# EAGLE board wordclock-r2-grid-routed (EAGLE 5.11)
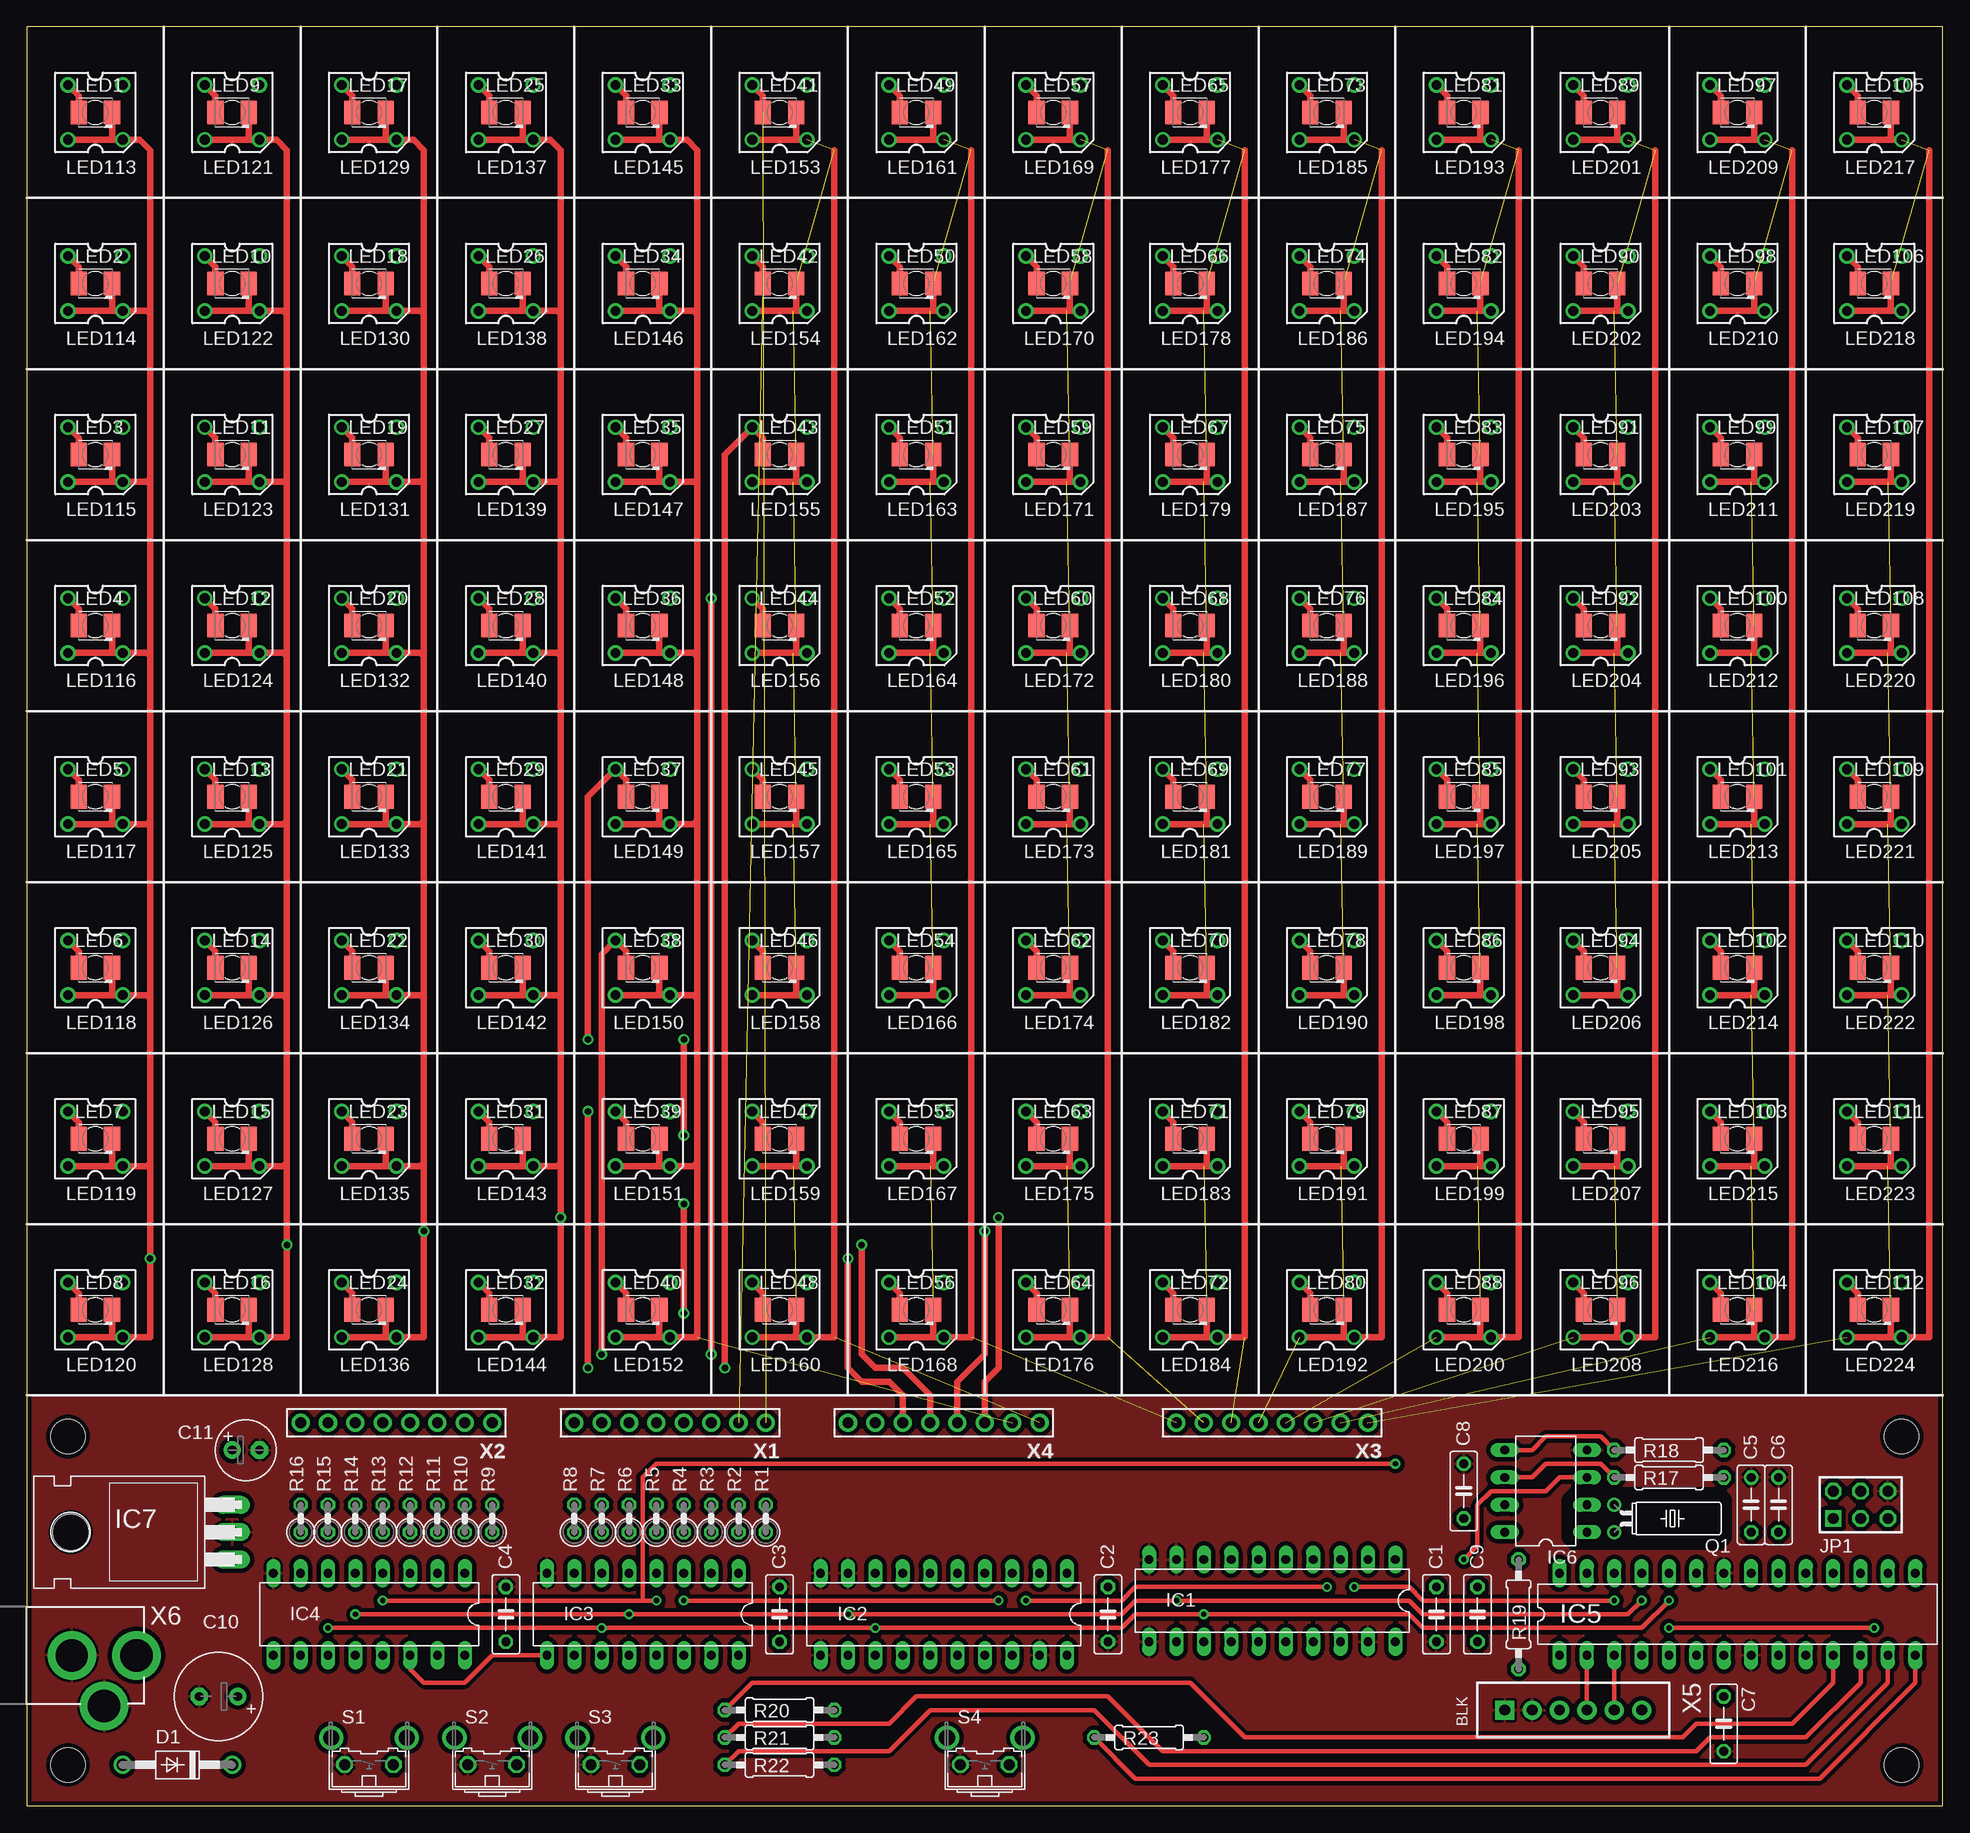
[diagram p2: board, top side]
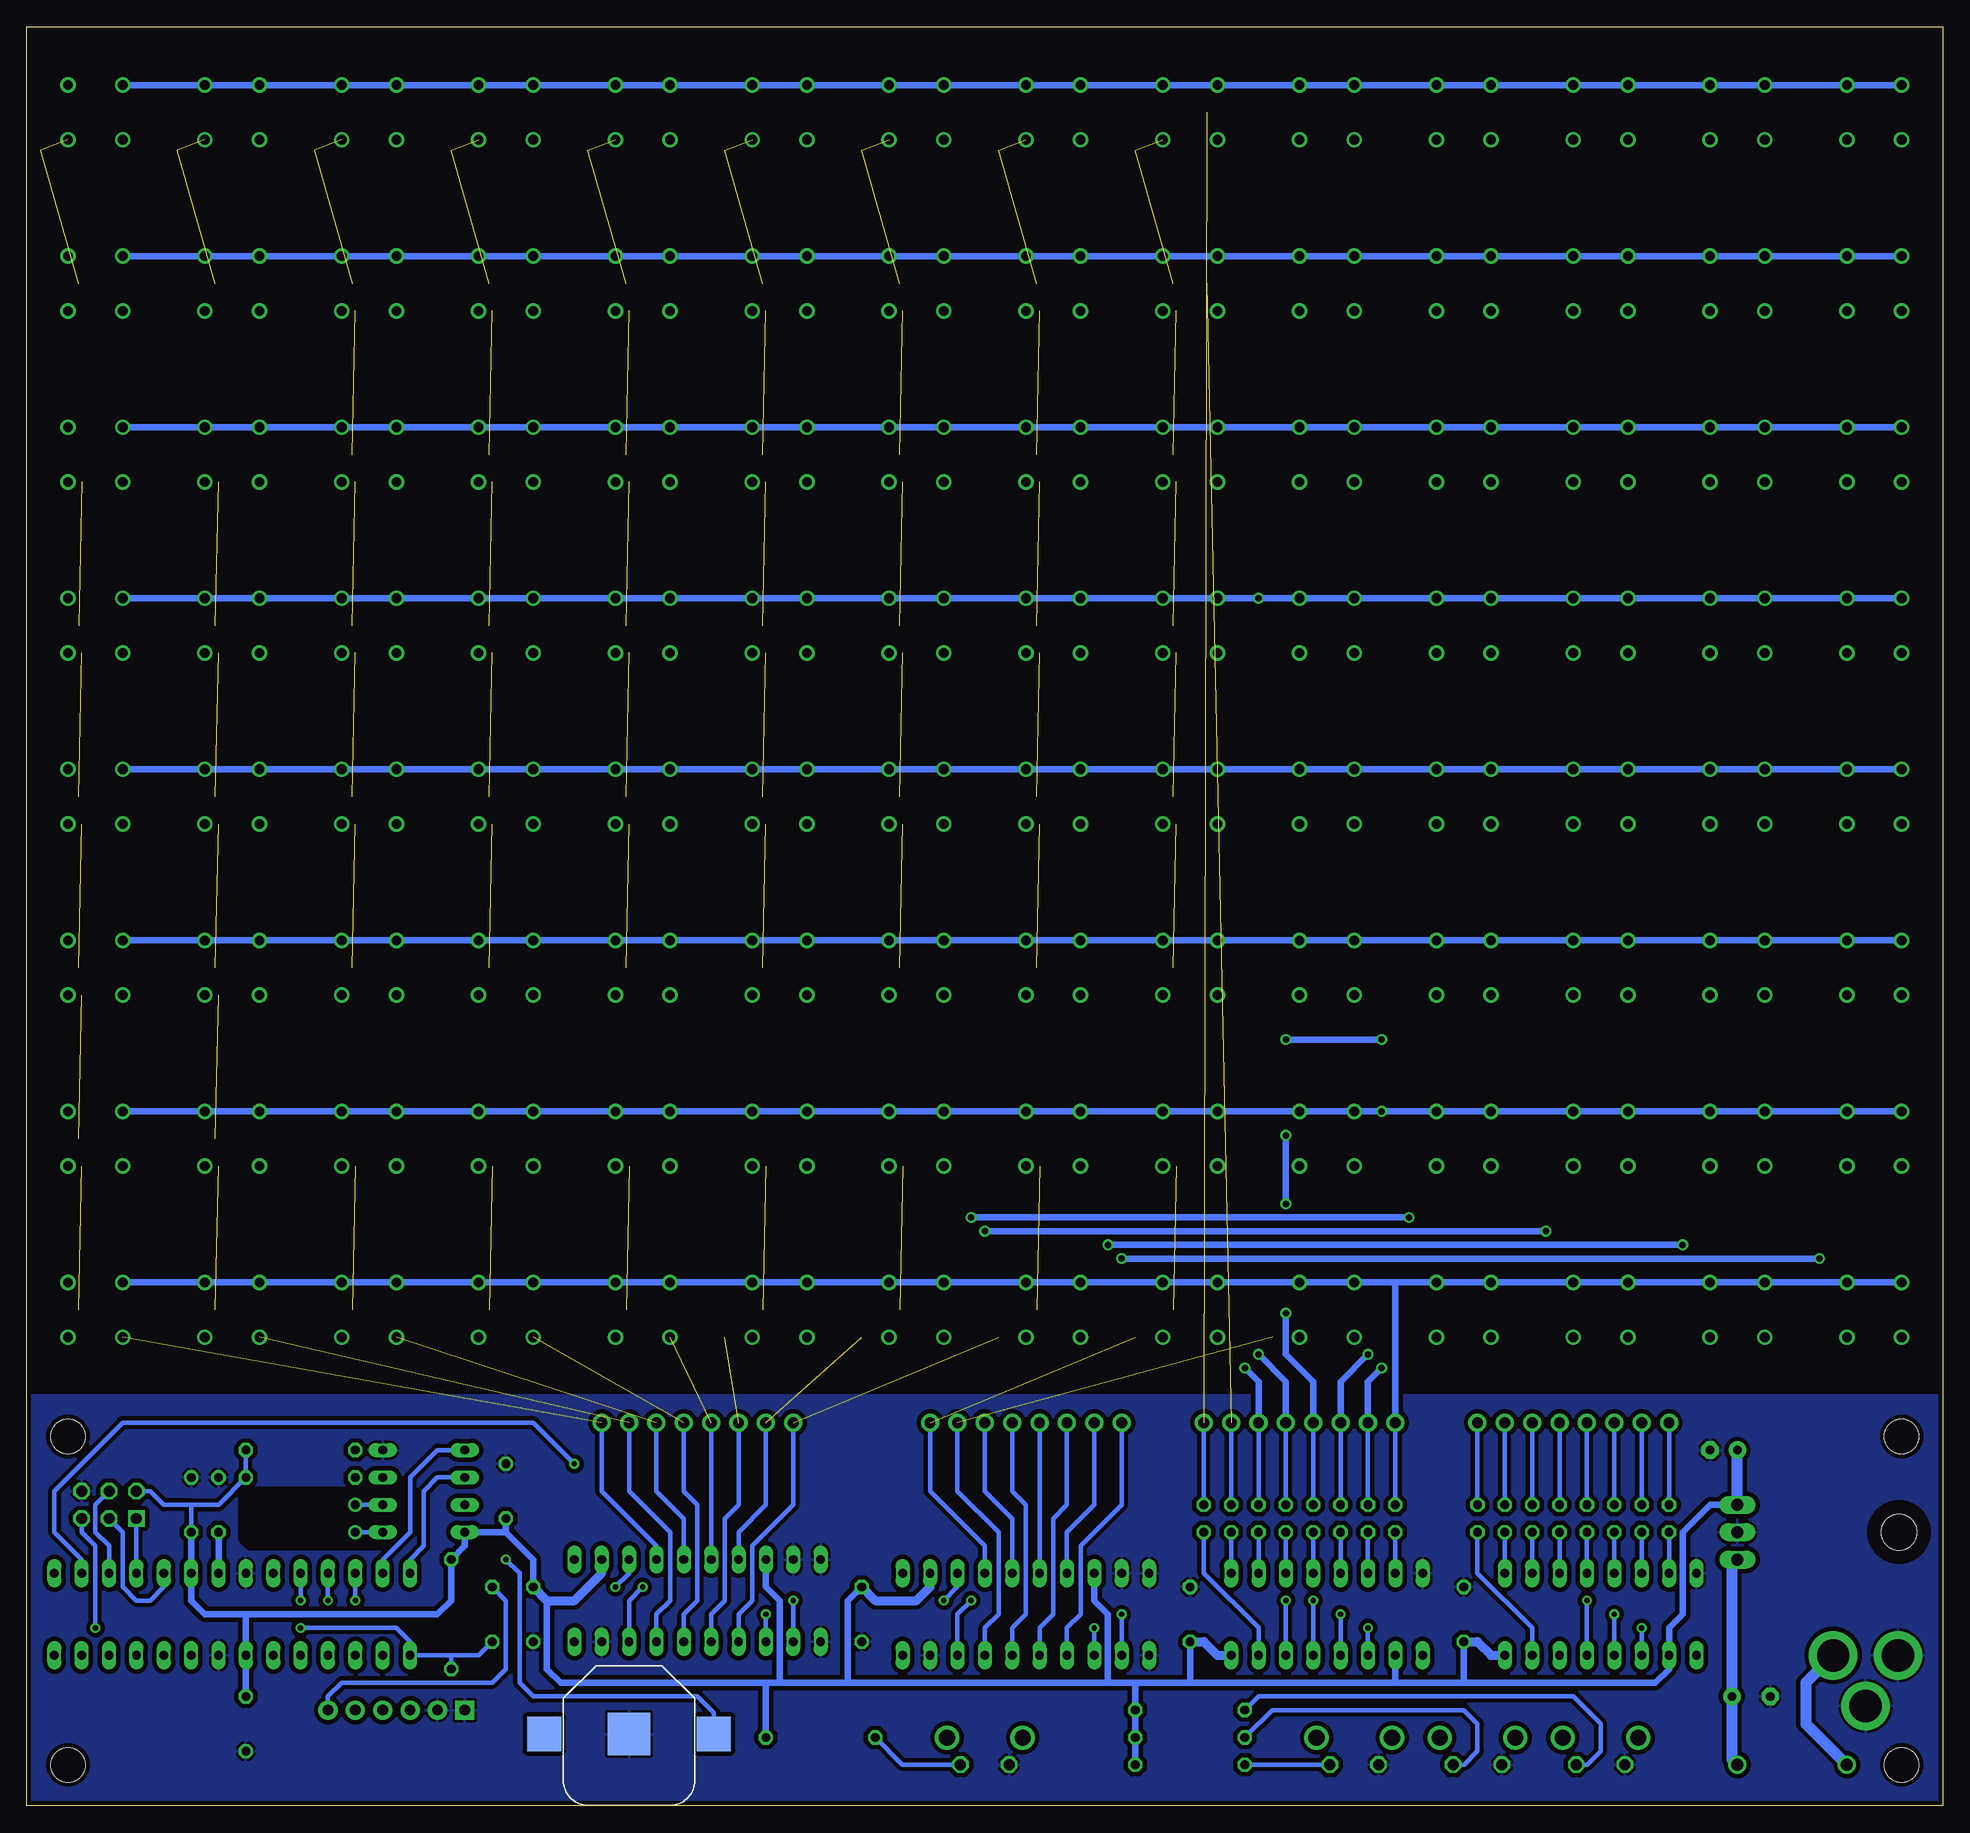
[diagram p3: board, bottom side, seen from below]

Size 177.8 x 165.1 mm. Coordinates in mm from the lower left corner, seen from the top.
Outline: 0,165.1 0,0 177.8,0 177.8,165.1 0,165.1
Copper layers (1*16): Top 0.035mm / dielectric 1.5mm / Bottom 0.035mm
Design rules "default": minimum track width 10mil, minimum drill 19mil, track to track 8mil, track to pad 8mil, pad to pad 8mil, via to via 8mil, smd to smd 8mil, copper to edge 10mil, drill to drill 8mil, minimum pad ring 10mil, minimum via ring 8mil, stop-mask expansion 4mil, vias tented up to drill 0mil, thermal gap 10mil
Holes 3.2 mm at 3.81,34.29 173.99,34.29 173.99,3.81 3.81,3.81
tRestrict: 8 lines
bRestrict: 8 lines

## Footprints (pad centres in the part's own frame; a part is rotated, then mirrored left to right if it is on the bottom)
BATTCON_12MM = smd 3.962 x 3.962: GND 0,0 | smd 3.175 x 3.175: PWR@1 -7.874,0; PWR@2 7.874,0
C050-025X075 = drill 0.813 octagon: 1 -2.54,0; 2 2.54,0
E3,5-8 = drill 0.813 pad 1.6 round: + -1.778,0 | drill 0.813 pad 1.6 octagon: - 1.778,0
E2,5-6 = drill 0.813 pad 1.6 round: + -1.27,0 | drill 0.813 pad 1.6 octagon: - 1.27,0
DO41-10 = drill 1.118 round: A 5.08,0; C -5.08,0
DIL20 = drill 0.813 long: 1 -11.43,-3.81; 2 -8.89,-3.81; 3 -6.35,-3.81; 4 -3.81,-3.81; 5 -1.27,-3.81; 6 1.27,-3.81; 7 3.81,-3.81; 8 6.35,-3.81; 9 8.89,-3.81; 10 11.43,-3.81; 11 11.43,3.81; 12 8.89,3.81; 13 6.35,3.81; 14 3.81,3.81; 15 1.27,3.81; 16 -1.27,3.81; 17 -3.81,3.81; 18 -6.35,3.81; 19 -8.89,3.81; 20 -11.43,3.81
DIL16 = drill 0.813 long: 1 -8.89,-3.81; 2 -6.35,-3.81; 3 -3.81,-3.81; 4 -1.27,-3.81; 5 1.27,-3.81; 6 3.81,-3.81; 7 6.35,-3.81; 8 8.89,-3.81; 9 8.89,3.81; 10 6.35,3.81; 11 3.81,3.81; 12 1.27,3.81; 13 -1.27,3.81; 14 -3.81,3.81; 15 -6.35,3.81; 16 -8.89,3.81
DIL28-3 = drill 0.813 long: 1 -16.51,-3.81; 2 -13.97,-3.81; 3 -11.43,-3.81; 4 -8.89,-3.81; 5 -6.35,-3.81; 6 -3.81,-3.81; 7 -1.27,-3.81; 8 1.27,-3.81; 9 3.81,-3.81; 10 6.35,-3.81; 11 8.89,-3.81; 12 11.43,-3.81; 13 13.97,-3.81; 14 16.51,-3.81; 15 16.51,3.81; 16 13.97,3.81; 17 11.43,3.81; 18 8.89,3.81; 19 6.35,3.81; 20 3.81,3.81; 21 1.27,3.81; 22 -1.27,3.81; 23 -3.81,3.81; 24 -6.35,3.81; 25 -8.89,3.81; 26 -11.43,3.81; 27 -13.97,3.81; 28 -16.51,3.81
DIL08 = drill 0.813 long: 1 -3.81,-3.81; 2 -1.27,-3.81; 3 1.27,-3.81; 4 3.81,-3.81; 5 3.81,3.81; 6 1.27,3.81; 7 -1.27,3.81; 8 -3.81,3.81
TO220H = drill 1.118 long: 1 -2.54,-10.16; 2 0,-10.16; 3 2.54,-10.16 | hole 3.302: 0,4.826
AVR-ISP-6 = drill 1.016 square: 1 -2.54,-1.27 | drill 1.016 octagon: 2 -2.54,1.27; 3 0,-1.27; 4 0,1.27; 5 2.54,-1.27; 6 2.54,1.27
KA-3528ASYC = smd 1.5 x 2.2: A -1.55,0; C 1.55,0
SUPERFLUX-7.6X7.6 = drill 0.9 pad 1.422 round: 1 -2.54,2.54; 2 2.54,2.54; 3 -2.54,-2.54; 4 2.54,-2.54
TC38H = drill 0.813 round: 1 -1.27,0; 2 1.27,0
0207/2V = drill 0.813 octagon: 1 -1.27,0; 2 1.27,0
0207/10 = drill 0.813 octagon: 1 -5.08,0; 2 5.08,0
B3F-31XX = drill 1.016 octagon: 1 -2.261,-1.245; 2 2.261,-1.245 | drill 1.499 pad 2.159 round: 3 -3.505,1.245; 4 3.505,1.245
100MIL-8 = drill 1 pad 1.676 round: 1 -8.89,0; 2 -6.35,0; 3 -3.81,0; 4 -1.27,0; 5 1.27,0; 6 3.81,0; 7 6.35,0; 8 8.89,0
USBCABLE-0.100-NOLBL = drill 1 pad 1.778 square: 1 0,-7.62 | drill 1 pad 1.778 round: 2 0,-5.08; 3 0,-2.54; 4 0,0; 5 0,2.54; 6 0,5.08
PJ-002 = drill 3 pad 4.5 round: 1 0,0; 2 0,6; 3 -4.7,3

## Placement (x,y rotation side)
BAT1  [BATTCON_12MM]  121.92,6.67 180 bottom
C1  [C050-025X075]  130.81,17.78 270 top
C2  [C050-025X075]  100.33,17.78 270 top
C3  [C050-025X075]  69.85,17.78 90 top
C4  [C050-025X075]  44.45,17.78 90 top
C5  [C050-025X075]  160.02,27.94 90 top
C6  [C050-025X075]  162.56,27.94 90 top
C7  [C050-025X075]  157.48,7.62 270 top
C8  [C050-025X075]  133.35,29.21 90 top
C9  [C050-025X075]  134.62,17.78 270 top
C10  100u  [E3,5-8]  17.78,10.16 180 top
C11  10u  [E2,5-6]  20.32,33.02 0 top
D1  1N4004  [DO41-10]  13.97,3.81 180 top
IC1  TPIC6B595  [DIL20]  115.57,19.05 180 top
IC2  TPIC6B595  [DIL20]  85.09,17.78 180 top
IC3  74LS595N  [DIL16]  57.15,17.78 180 top
IC4  74LS595N  [DIL16]  31.75,17.78 180 top
IC5  MEGA48/88/168-PU  [DIL28-3]  158.75,17.78 0 top
IC6  DS1307  [DIL08]  140.97,29.21 90 top
IC7  7805T  [TO220H]  8.89,25.4 90 top
JP1  AVR-ISP-6  [AVR-ISP-6]  170.18,27.94 0 top
LED1  [KA-3528ASYC]  6.35,157.16 0 top
LED2  [KA-3528ASYC]  6.35,141.29 0 top
LED3  [KA-3528ASYC]  6.35,125.41 0 top
LED4  [KA-3528ASYC]  6.35,109.54 0 top
LED5  [KA-3528ASYC]  6.35,93.66 0 top
LED6  [KA-3528ASYC]  6.35,77.79 0 top
LED7  [KA-3528ASYC]  6.35,61.91 0 top
LED8  [KA-3528ASYC]  6.35,46.04 0 top
LED9  [KA-3528ASYC]  19.05,157.16 0 top
LED10  [KA-3528ASYC]  19.05,141.29 0 top
LED11  [KA-3528ASYC]  19.05,125.41 0 top
LED12  [KA-3528ASYC]  19.05,109.54 0 top
LED13  [KA-3528ASYC]  19.05,93.66 0 top
LED14  [KA-3528ASYC]  19.05,77.79 0 top
LED15  [KA-3528ASYC]  19.05,61.91 0 top
LED16  [KA-3528ASYC]  19.05,46.04 0 top
LED17  [KA-3528ASYC]  31.75,157.16 0 top
LED18  [KA-3528ASYC]  31.75,141.29 0 top
LED19  [KA-3528ASYC]  31.75,125.41 0 top
LED20  [KA-3528ASYC]  31.75,109.54 0 top
LED21  [KA-3528ASYC]  31.75,93.66 0 top
LED22  [KA-3528ASYC]  31.75,77.79 0 top
LED23  [KA-3528ASYC]  31.75,61.91 0 top
LED24  [KA-3528ASYC]  31.75,46.04 0 top
LED25  [KA-3528ASYC]  44.45,157.16 0 top
LED26  [KA-3528ASYC]  44.45,141.29 0 top
LED27  [KA-3528ASYC]  44.45,125.41 0 top
LED28  [KA-3528ASYC]  44.45,109.54 0 top
LED29  [KA-3528ASYC]  44.45,93.66 0 top
LED30  [KA-3528ASYC]  44.45,77.79 0 top
LED31  [KA-3528ASYC]  44.45,61.91 0 top
LED32  [KA-3528ASYC]  44.45,46.04 0 top
LED33  [KA-3528ASYC]  57.15,157.16 0 top
LED34  [KA-3528ASYC]  57.15,141.29 0 top
LED35  [KA-3528ASYC]  57.15,125.41 0 top
LED36  [KA-3528ASYC]  57.15,109.54 0 top
LED37  [KA-3528ASYC]  57.15,93.66 0 top
LED38  [KA-3528ASYC]  57.15,77.79 0 top
LED39  [KA-3528ASYC]  57.15,61.91 0 top
LED40  [KA-3528ASYC]  57.15,46.04 0 top
LED41  [KA-3528ASYC]  69.85,157.16 0 top
LED42  [KA-3528ASYC]  69.85,141.29 0 top
LED43  [KA-3528ASYC]  69.85,125.41 0 top
LED44  [KA-3528ASYC]  69.85,109.54 0 top
LED45  [KA-3528ASYC]  69.85,93.66 0 top
LED46  [KA-3528ASYC]  69.85,77.79 0 top
LED47  [KA-3528ASYC]  69.85,61.91 0 top
LED48  [KA-3528ASYC]  69.85,46.04 0 top
LED49  [KA-3528ASYC]  82.55,157.16 0 top
LED50  [KA-3528ASYC]  82.55,141.29 0 top
LED51  [KA-3528ASYC]  82.55,125.41 0 top
LED52  [KA-3528ASYC]  82.55,109.54 0 top
LED53  [KA-3528ASYC]  82.55,93.66 0 top
LED54  [KA-3528ASYC]  82.55,77.79 0 top
LED55  [KA-3528ASYC]  82.55,61.91 0 top
LED56  [KA-3528ASYC]  82.55,46.04 0 top
LED57  [KA-3528ASYC]  95.25,157.16 0 top
LED58  [KA-3528ASYC]  95.25,141.29 0 top
LED59  [KA-3528ASYC]  95.25,125.41 0 top
LED60  [KA-3528ASYC]  95.25,109.54 0 top
LED61  [KA-3528ASYC]  95.25,93.66 0 top
LED62  [KA-3528ASYC]  95.25,77.79 0 top
LED63  [KA-3528ASYC]  95.25,61.91 0 top
LED64  [KA-3528ASYC]  95.25,46.04 0 top
LED65  [KA-3528ASYC]  107.95,157.16 0 top
LED66  [KA-3528ASYC]  107.95,141.29 0 top
LED67  [KA-3528ASYC]  107.95,125.41 0 top
LED68  [KA-3528ASYC]  107.95,109.54 0 top
LED69  [KA-3528ASYC]  107.95,93.66 0 top
LED70  [KA-3528ASYC]  107.95,77.79 0 top
LED71  [KA-3528ASYC]  107.95,61.91 0 top
LED72  [KA-3528ASYC]  107.95,46.04 0 top
LED73  [KA-3528ASYC]  120.65,157.16 0 top
LED74  [KA-3528ASYC]  120.65,141.29 0 top
LED75  [KA-3528ASYC]  120.65,125.41 0 top
LED76  [KA-3528ASYC]  120.65,109.54 0 top
LED77  [KA-3528ASYC]  120.65,93.66 0 top
LED78  [KA-3528ASYC]  120.65,77.79 0 top
LED79  [KA-3528ASYC]  120.65,61.91 0 top
LED80  [KA-3528ASYC]  120.65,46.04 0 top
LED81  [KA-3528ASYC]  133.35,157.16 0 top
LED82  [KA-3528ASYC]  133.35,141.29 0 top
LED83  [KA-3528ASYC]  133.35,125.41 0 top
LED84  [KA-3528ASYC]  133.35,109.54 0 top
LED85  [KA-3528ASYC]  133.35,93.66 0 top
LED86  [KA-3528ASYC]  133.35,77.79 0 top
LED87  [KA-3528ASYC]  133.35,61.91 0 top
LED88  [KA-3528ASYC]  133.35,46.04 0 top
LED89  [KA-3528ASYC]  146.05,157.16 0 top
LED90  [KA-3528ASYC]  146.05,141.29 0 top
LED91  [KA-3528ASYC]  146.05,125.41 0 top
LED92  [KA-3528ASYC]  146.05,109.54 0 top
LED93  [KA-3528ASYC]  146.05,93.66 0 top
LED94  [KA-3528ASYC]  146.05,77.79 0 top
LED95  [KA-3528ASYC]  146.05,61.91 0 top
LED96  [KA-3528ASYC]  146.05,46.04 0 top
LED97  [KA-3528ASYC]  158.75,157.16 0 top
LED98  [KA-3528ASYC]  158.75,141.29 0 top
LED99  [KA-3528ASYC]  158.75,125.41 0 top
LED100  [KA-3528ASYC]  158.75,109.54 0 top
LED101  [KA-3528ASYC]  158.75,93.66 0 top
LED102  [KA-3528ASYC]  158.75,77.79 0 top
LED103  [KA-3528ASYC]  158.75,61.91 0 top
LED104  [KA-3528ASYC]  158.75,46.04 0 top
LED105  [KA-3528ASYC]  171.45,157.16 0 top
LED106  [KA-3528ASYC]  171.45,141.29 0 top
LED107  [KA-3528ASYC]  171.45,125.41 0 top
LED108  [KA-3528ASYC]  171.45,109.54 0 top
LED109  [KA-3528ASYC]  171.45,93.66 0 top
LED110  [KA-3528ASYC]  171.45,77.79 0 top
LED111  [KA-3528ASYC]  171.45,61.91 0 top
LED112  [KA-3528ASYC]  171.45,46.04 0 top
LED113  [SUPERFLUX-7.6X7.6]  6.35,157.16 90 top
LED114  [SUPERFLUX-7.6X7.6]  6.35,141.29 90 top
LED115  [SUPERFLUX-7.6X7.6]  6.35,125.41 90 top
LED116  [SUPERFLUX-7.6X7.6]  6.35,109.54 90 top
LED117  [SUPERFLUX-7.6X7.6]  6.35,93.66 90 top
LED118  [SUPERFLUX-7.6X7.6]  6.35,77.79 90 top
LED119  [SUPERFLUX-7.6X7.6]  6.35,61.91 90 top
LED120  [SUPERFLUX-7.6X7.6]  6.35,46.04 90 top
LED121  [SUPERFLUX-7.6X7.6]  19.05,157.16 90 top
LED122  [SUPERFLUX-7.6X7.6]  19.05,141.29 90 top
LED123  [SUPERFLUX-7.6X7.6]  19.05,125.41 90 top
LED124  [SUPERFLUX-7.6X7.6]  19.05,109.54 90 top
LED125  [SUPERFLUX-7.6X7.6]  19.05,93.66 90 top
LED126  [SUPERFLUX-7.6X7.6]  19.05,77.79 90 top
LED127  [SUPERFLUX-7.6X7.6]  19.05,61.91 90 top
LED128  [SUPERFLUX-7.6X7.6]  19.05,46.04 90 top
LED129  [SUPERFLUX-7.6X7.6]  31.75,157.16 90 top
LED130  [SUPERFLUX-7.6X7.6]  31.75,141.29 90 top
LED131  [SUPERFLUX-7.6X7.6]  31.75,125.41 90 top
LED132  [SUPERFLUX-7.6X7.6]  31.75,109.54 90 top
LED133  [SUPERFLUX-7.6X7.6]  31.75,93.66 90 top
LED134  [SUPERFLUX-7.6X7.6]  31.75,77.79 90 top
LED135  [SUPERFLUX-7.6X7.6]  31.75,61.91 90 top
LED136  [SUPERFLUX-7.6X7.6]  31.75,46.04 90 top
LED137  [SUPERFLUX-7.6X7.6]  44.45,157.16 90 top
LED138  [SUPERFLUX-7.6X7.6]  44.45,141.29 90 top
LED139  [SUPERFLUX-7.6X7.6]  44.45,125.41 90 top
LED140  [SUPERFLUX-7.6X7.6]  44.45,109.54 90 top
LED141  [SUPERFLUX-7.6X7.6]  44.45,93.66 90 top
LED142  [SUPERFLUX-7.6X7.6]  44.45,77.79 90 top
LED143  [SUPERFLUX-7.6X7.6]  44.45,61.91 90 top
LED144  [SUPERFLUX-7.6X7.6]  44.45,46.04 90 top
LED145  [SUPERFLUX-7.6X7.6]  57.15,157.16 90 top
LED146  [SUPERFLUX-7.6X7.6]  57.15,141.29 90 top
LED147  [SUPERFLUX-7.6X7.6]  57.15,125.41 90 top
LED148  [SUPERFLUX-7.6X7.6]  57.15,109.54 90 top
LED149  [SUPERFLUX-7.6X7.6]  57.15,93.66 90 top
LED150  [SUPERFLUX-7.6X7.6]  57.15,77.79 90 top
LED151  [SUPERFLUX-7.6X7.6]  57.15,61.91 90 top
LED152  [SUPERFLUX-7.6X7.6]  57.15,46.04 90 top
LED153  [SUPERFLUX-7.6X7.6]  69.85,157.16 90 top
LED154  [SUPERFLUX-7.6X7.6]  69.85,141.29 90 top
LED155  [SUPERFLUX-7.6X7.6]  69.85,125.41 90 top
LED156  [SUPERFLUX-7.6X7.6]  69.85,109.54 90 top
LED157  [SUPERFLUX-7.6X7.6]  69.85,93.66 90 top
LED158  [SUPERFLUX-7.6X7.6]  69.85,77.79 90 top
LED159  [SUPERFLUX-7.6X7.6]  69.85,61.91 90 top
LED160  [SUPERFLUX-7.6X7.6]  69.85,46.04 90 top
LED161  [SUPERFLUX-7.6X7.6]  82.55,157.16 90 top
LED162  [SUPERFLUX-7.6X7.6]  82.55,141.29 90 top
LED163  [SUPERFLUX-7.6X7.6]  82.55,125.41 90 top
LED164  [SUPERFLUX-7.6X7.6]  82.55,109.54 90 top
LED165  [SUPERFLUX-7.6X7.6]  82.55,93.66 90 top
LED166  [SUPERFLUX-7.6X7.6]  82.55,77.79 90 top
LED167  [SUPERFLUX-7.6X7.6]  82.55,61.91 90 top
LED168  [SUPERFLUX-7.6X7.6]  82.55,46.04 90 top
LED169  [SUPERFLUX-7.6X7.6]  95.25,157.16 90 top
LED170  [SUPERFLUX-7.6X7.6]  95.25,141.29 90 top
LED171  [SUPERFLUX-7.6X7.6]  95.25,125.41 90 top
LED172  [SUPERFLUX-7.6X7.6]  95.25,109.54 90 top
LED173  [SUPERFLUX-7.6X7.6]  95.25,93.66 90 top
LED174  [SUPERFLUX-7.6X7.6]  95.25,77.79 90 top
LED175  [SUPERFLUX-7.6X7.6]  95.25,61.91 90 top
LED176  [SUPERFLUX-7.6X7.6]  95.25,46.04 90 top
LED177  [SUPERFLUX-7.6X7.6]  107.95,157.16 90 top
LED178  [SUPERFLUX-7.6X7.6]  107.95,141.29 90 top
LED179  [SUPERFLUX-7.6X7.6]  107.95,125.41 90 top
LED180  [SUPERFLUX-7.6X7.6]  107.95,109.54 90 top
LED181  [SUPERFLUX-7.6X7.6]  107.95,93.66 90 top
LED182  [SUPERFLUX-7.6X7.6]  107.95,77.79 90 top
LED183  [SUPERFLUX-7.6X7.6]  107.95,61.91 90 top
LED184  [SUPERFLUX-7.6X7.6]  107.95,46.04 90 top
LED185  [SUPERFLUX-7.6X7.6]  120.65,157.16 90 top
LED186  [SUPERFLUX-7.6X7.6]  120.65,141.29 90 top
LED187  [SUPERFLUX-7.6X7.6]  120.65,125.41 90 top
LED188  [SUPERFLUX-7.6X7.6]  120.65,109.54 90 top
LED189  [SUPERFLUX-7.6X7.6]  120.65,93.66 90 top
LED190  [SUPERFLUX-7.6X7.6]  120.65,77.79 90 top
LED191  [SUPERFLUX-7.6X7.6]  120.65,61.91 90 top
LED192  [SUPERFLUX-7.6X7.6]  120.65,46.04 90 top
LED193  [SUPERFLUX-7.6X7.6]  133.35,157.16 90 top
LED194  [SUPERFLUX-7.6X7.6]  133.35,141.29 90 top
LED195  [SUPERFLUX-7.6X7.6]  133.35,125.41 90 top
LED196  [SUPERFLUX-7.6X7.6]  133.35,109.54 90 top
LED197  [SUPERFLUX-7.6X7.6]  133.35,93.66 90 top
LED198  [SUPERFLUX-7.6X7.6]  133.35,77.79 90 top
LED199  [SUPERFLUX-7.6X7.6]  133.35,61.91 90 top
LED200  [SUPERFLUX-7.6X7.6]  133.35,46.04 90 top
LED201  [SUPERFLUX-7.6X7.6]  146.05,157.16 90 top
LED202  [SUPERFLUX-7.6X7.6]  146.05,141.29 90 top
LED203  [SUPERFLUX-7.6X7.6]  146.05,125.41 90 top
LED204  [SUPERFLUX-7.6X7.6]  146.05,109.54 90 top
LED205  [SUPERFLUX-7.6X7.6]  146.05,93.66 90 top
LED206  [SUPERFLUX-7.6X7.6]  146.05,77.79 90 top
LED207  [SUPERFLUX-7.6X7.6]  146.05,61.91 90 top
LED208  [SUPERFLUX-7.6X7.6]  146.05,46.04 90 top
LED209  [SUPERFLUX-7.6X7.6]  158.75,157.16 90 top
LED210  [SUPERFLUX-7.6X7.6]  158.75,141.29 90 top
LED211  [SUPERFLUX-7.6X7.6]  158.75,125.41 90 top
LED212  [SUPERFLUX-7.6X7.6]  158.75,109.54 90 top
LED213  [SUPERFLUX-7.6X7.6]  158.75,93.66 90 top
LED214  [SUPERFLUX-7.6X7.6]  158.75,77.79 90 top
LED215  [SUPERFLUX-7.6X7.6]  158.75,61.91 90 top
LED216  [SUPERFLUX-7.6X7.6]  158.75,46.04 90 top
LED217  [SUPERFLUX-7.6X7.6]  171.45,157.16 90 top
LED218  [SUPERFLUX-7.6X7.6]  171.45,141.29 90 top
LED219  [SUPERFLUX-7.6X7.6]  171.45,125.41 90 top
LED220  [SUPERFLUX-7.6X7.6]  171.45,109.54 90 top
LED221  [SUPERFLUX-7.6X7.6]  171.45,93.66 90 top
LED222  [SUPERFLUX-7.6X7.6]  171.45,77.79 90 top
LED223  [SUPERFLUX-7.6X7.6]  171.45,61.91 90 top
LED224  [SUPERFLUX-7.6X7.6]  171.45,46.04 90 top
Q1  [TC38H]  147.32,26.67 270 top
R1  [0207/2V]  68.58,26.67 90 top
R2  [0207/2V]  66.04,26.67 90 top
R3  [0207/2V]  63.5,26.67 90 top
R4  [0207/2V]  60.96,26.67 90 top
R5  [0207/2V]  58.42,26.67 90 top
R6  [0207/2V]  55.88,26.67 90 top
R7  [0207/2V]  53.34,26.67 90 top
R8  [0207/2V]  50.8,26.67 90 top
R9  [0207/2V]  43.18,26.67 90 top
R10  [0207/2V]  40.64,26.67 90 top
R11  [0207/2V]  38.1,26.67 90 top
R12  [0207/2V]  35.56,26.67 90 top
R13  [0207/2V]  33.02,26.67 90 top
R14  [0207/2V]  30.48,26.67 90 top
R15  [0207/2V]  27.94,26.67 90 top
R16  [0207/2V]  25.4,26.67 90 top
R17  [0207/10]  152.4,30.48 0 top
R18  [0207/10]  152.4,33.02 0 top
R19  [0207/10]  138.43,17.78 90 top
R20  [0207/10]  69.85,8.89 0 top
R21  [0207/10]  69.85,6.35 0 top
R22  [0207/10]  69.85,3.81 0 top
R23  [0207/10]  104.14,6.35 0 top
S1  [B3F-31XX]  31.75,5.08 0 top
S2  [B3F-31XX]  43.18,5.08 0 top
S3  [B3F-31XX]  54.61,5.08 0 top
S4  [B3F-31XX]  88.9,5.08 0 top
X1  M08-100MIL  [100MIL-8]  59.69,35.56 180 top
X2  M08-100MIL  [100MIL-8]  34.29,35.56 180 top
X3  M08-100MIL  [100MIL-8]  115.57,35.56 180 top
X4  M08-100MIL  [100MIL-8]  85.09,35.56 180 top
X5  TTL-232R-5VN  [USBCABLE-0.100-NOLBL]  144.78,8.89 270 top
X6  PJ-002B  [PJ-002]  10.16,13.97 90 top

## Tracks (layer width: path | path; a pad name or v marks a point on that pad's centre or on a via)
+5V
  Bottom 0.406: R18.2 R17.2 160.02,27.94 162.56,27.94 | C6.1 162.56,27.94 | 162.56,27.94 165.1,27.94 166.37,29.21 JP1.2
  Bottom 0.61: 44.45,11.43 26.67,11.43 25.4,12.7 IC4.10 25.4,16.51 24.13,17.78 24.13,25.4 21.59,27.94 IC7.3 | 44.45,11.43 50.8,11.43 | 50.8,11.43 69.85,11.43 | 69.85,11.43 74.93,11.43 | 74.93,11.43 77.47,11.43 | 77.47,11.43 101.6,11.43 | 101.6,11.43 107.95,11.43 | C2.1 101.6,19.05 101.6,11.43 | 69.85,11.43 C3.1 | 44.45,11.43 C4.1 | 50.8,11.43 IC3.10 | IC2.8 78.74,19.05 77.47,17.78 77.47,11.43 | IC1.8 109.22,20.32 107.95,19.05 107.95,11.43 | C7.1 IC5.7 157.48,17.78 | C6.1 IC5.20 162.56,19.05 161.29,17.78 157.48,17.78 | 107.95,11.43 109.22,11.43 | 109.22,11.43 128.27,11.43 129.54,12.7 129.54,19.05 | C1.1 130.81,22.86 133.35,25.4 | 133.35,25.4 IC6.8 137.16,24.13 R19.2 138.43,19.05 139.7,17.78 157.48,17.78 | 133.35,25.4 C8.1 | R22.2 R21.2 R20.2 74.93,11.43 | 109.22,11.43 R23.2
  Bottom 0.813: C4.1 43.18,15.24 41.91,13.97 IC4.16 | C3.1 68.58,15.24 67.31,13.97 IC3.16 | IC2.2 93.98,20.32 95.25,19.05 99.06,19.05 C2.1 | IC1.2 124.46,21.59 127,19.05 129.54,19.05 C1.1
  Bottom 1.016: IC7.3 C11.+
BRIGHT  (via drill 0.5)
  Top 0.406: v33.02,19.05 57.15,19.05 | 57.15,19.05 v58.42,19.05 | v127,31.75 58.42,31.75 57.15,30.48 57.15,19.05
  Bottom 0.406: v58.42,19.05 IC3.13 | IC4.13 v33.02,19.05 | IC5.16 172.72,22.86 175.26,25.4 175.26,29.21 168.91,35.56 130.81,35.56 v127,31.75
BUTTON1
  Top 0.406: IC5.11 167.64,11.43 163.83,7.62 154.94,7.62 153.67,6.35 113.03,6.35 107.95,11.43 67.31,11.43 R20.1
  Bottom 0.406: R20.1 63.5,10.16 34.29,10.16 31.75,7.62 31.75,5.08 32.99,3.84 S1.2
BUTTON2
  Top 0.406: IC5.12 170.18,11.43 165.1,6.35 156.21,6.35 154.94,5.08 105.41,5.08 100.33,10.16 82.55,10.16 80.01,7.62 66.04,7.62 R21.1
  Bottom 0.406: R21.1 62.23,8.89 44.45,8.89 43.18,7.62 43.18,5.08 44.42,3.84 S2.2
BUTTON3
  Top 0.406: IC5.13 172.72,11.43 165.1,3.81 104.14,3.81 99.06,8.89 83.82,8.89 80.01,5.08 66.04,5.08 R22.1
  Bottom 0.406: S3.2 57.12,3.84 57.15,3.81 R22.1
BUTTON4
  Top 0.406: IC5.14 175.26,11.43 166.37,2.54 102.87,2.54 R23.1
  Bottom 0.406: S4.2 96.55,3.84 R23.1
CLOCK  (via drill 0.5)
  Top 0.406: v27.94,16.51 v53.34,16.51 v78.74,16.51 101.6,16.51 102.87,17.78 v109.22,17.78 128.27,17.78 129.54,16.51 149.86,16.51 v152.4,19.05
  Bottom 0.406: IC4.11 v27.94,16.51 | v109.22,17.78 IC1.13 | v53.34,16.51 IC3.11 | v78.74,16.51 IC2.13 | v152.4,19.05 IC5.24
COL1  (8 unrouted)
  Top 0.61: LED218.1 172.72,138.75 | 172.72,138.75 LED218.3 | LED106.C 173,139.03 172.72,138.75 | LED217.1 172.72,154.62 | 172.72,154.62 LED217.3 | LED105.C 173,154.9 172.72,154.62 | LED222.1 172.72,75.25 | 172.72,75.25 LED222.3 | LED223.1 172.72,59.37 | 172.72,59.37 LED223.3 | 172.72,43.5 LED224.1 176.53,43.5 176.53,153.67 | 172.72,43.5 LED224.3 | LED110.C 173,75.53 172.72,75.25 | LED111.C 173,59.65 172.72,59.37 | LED112.C 173,43.78 172.72,43.5 | LED219.3 172.72,122.87 | 172.72,122.87 LED219.1 | LED220.1 172.72,107 | 172.72,107 LED220.3 | LED221.1 172.72,91.12 | 172.72,91.12 LED221.3 | LED107.C 173,123.15 172.72,122.87 | LED108.C 173,107.28 172.72,107 | LED109.C 173,91.4 172.72,91.12
  Bottom 0.406: IC1.4 119.38,24.13 124.46,29.21 X3.1
COL2  (8 unrouted)
  Top 0.61: LED210.1 160.02,138.75 | 160.02,138.75 LED210.3 | LED98.C 160.3,139.03 160.02,138.75 | LED209.1 160.02,154.62 | 160.02,154.62 LED209.3 | LED97.C 160.3,154.9 160.02,154.62 | LED214.1 160.02,75.25 | 160.02,75.25 LED214.3 | 160.02,43.5 LED216.1 163.83,43.5 163.83,153.67 | 160.02,43.5 LED216.3 | LED215.1 160.02,59.37 | 160.02,59.37 LED215.3 | LED102.C 160.3,75.53 160.02,75.25 | LED103.C 160.3,59.65 160.02,59.37 | LED104.C 160.3,43.78 160.02,43.5 | LED211.1 160.02,122.87 | 160.02,122.87 LED211.3 | LED213.1 160.02,91.12 | 160.02,91.12 LED213.3 | LED212.1 160.02,107 | 160.02,107 LED212.3 | LED101.C 160.3,91.4 160.02,91.12 | LED100.C 160.3,107.28 160.02,107 | LED99.C 160.3,123.15 160.02,122.87
  Bottom 0.406: IC1.17 119.38,17.78 118.11,19.05 118.11,25.4 121.92,29.21 X3.2
COL3  (8 unrouted)
  Top 0.61: LED201.1 147.32,154.62 | 147.32,154.62 LED201.3 | LED89.C 147.6,154.9 147.32,154.62 | LED202.1 147.32,138.75 | 147.32,138.75 LED202.3 | LED90.C 147.6,139.03 147.32,138.75 | LED206.1 147.32,75.25 | 147.32,75.25 LED206.3 | 147.32,43.5 LED208.1 151.13,43.5 151.13,153.67 | 147.32,43.5 LED208.3 | LED207.1 147.32,59.37 | 147.32,59.37 LED207.3 | LED94.C 147.6,75.53 147.32,75.25 | LED95.C 147.6,59.65 147.32,59.37 | LED96.C 147.6,43.78 147.32,43.5 | LED203.1 147.32,122.87 | 147.32,122.87 LED203.3 | LED204.1 147.32,107 | 147.32,107 LED204.3 | LED205.1 147.32,91.12 | 147.32,91.12 LED205.3 | LED91.C 147.6,123.15 147.32,122.87 | LED92.C 147.6,107.28 147.32,107 | LED93.C 147.6,91.4 147.32,91.12
  Bottom 0.406: IC1.5 116.84,26.67 119.38,29.21 X3.3
COL4  (8 unrouted)
  Top 0.61: LED194.1 134.62,138.75 | 134.62,138.75 LED194.3 | LED82.C 134.9,139.03 134.62,138.75 | LED193.1 134.62,154.62 | 134.62,154.62 LED193.3 | LED81.C 134.9,154.9 134.62,154.62 | 134.62,43.5 LED200.1 138.43,43.5 138.43,153.67 | 134.62,43.5 LED200.3 | LED199.1 134.62,59.37 | 134.62,59.37 LED199.3 | LED198.1 134.62,75.25 | 134.62,75.25 LED198.3 | LED86.C 134.9,75.53 134.62,75.25 | LED87.C 134.9,59.65 134.62,59.37 | LED88.C 134.9,43.78 134.62,43.5 | LED195.1 134.62,122.87 | 134.62,122.87 LED195.3 | LED197.1 134.62,91.12 | 134.62,91.12 LED197.3 | LED196.1 134.62,107 | 134.62,107 LED196.3 | LED85.C 134.9,91.4 134.62,91.12 | LED84.C 134.9,107.28 134.62,107 | LED83.C 134.9,123.15 134.62,122.87
  Bottom 0.406: IC1.16 116.84,17.78 115.57,19.05 115.57,27.94 116.84,29.21 X3.4
COL5  (8 unrouted)
  Top 0.61: LED186.1 121.92,138.75 | 121.92,138.75 LED186.3 | LED185.1 121.92,154.62 | 121.92,154.62 LED185.3 | LED73.C 122.2,154.9 121.92,154.62 | LED74.C 122.2,139.03 121.92,138.75 | 121.92,43.5 LED192.1 125.73,43.5 125.73,153.67 | 121.92,43.5 LED192.3 | LED191.1 121.92,59.37 | 121.92,59.37 LED191.3 | LED190.1 121.92,75.25 | 121.92,75.25 LED190.3 | LED78.C 122.2,75.53 121.92,75.25 | LED79.C 122.2,59.65 121.92,59.37 | LED80.C 122.2,43.78 121.92,43.5 | LED187.1 121.92,122.87 | 121.92,122.87 LED187.3 | LED188.1 121.92,107 | 121.92,107 LED188.3 | LED189.1 121.92,91.12 | 121.92,91.12 LED189.3 | LED75.C 122.2,123.15 121.92,122.87 | LED76.C 122.2,107.28 121.92,107 | LED77.C 122.2,91.4 121.92,91.12
  Bottom 0.406: IC1.6 X3.5
COL6  (8 unrouted)
  Top 0.61: LED178.1 109.22,138.75 | 109.22,138.75 LED178.3 | LED66.C 109.5,139.03 109.22,138.75 | LED177.1 109.22,154.62 | 109.22,154.62 LED177.3 | LED65.C 109.5,154.9 109.22,154.62 | LED184.1 109.22,43.5 | 109.22,43.5 LED184.3 113.03,43.5 113.03,153.67 | LED183.1 109.22,59.37 | 109.22,59.37 LED183.3 | LED182.1 109.22,75.25 | 109.22,75.25 LED182.3 | LED70.C 109.5,75.53 109.22,75.25 | LED71.C 109.5,59.65 109.22,59.37 | LED72.C 109.5,43.78 109.22,43.5 | LED181.1 109.22,91.12 | 109.22,91.12 LED181.3 | LED180.1 109.22,107 | 109.22,107 LED180.3 | LED179.1 109.22,122.87 | 109.22,122.87 LED179.3 | LED67.C 109.5,123.15 109.22,122.87 | LED68.C 109.5,107.28 109.22,107 | LED69.C 109.5,91.4 109.22,91.12
  Bottom 0.406: X3.6 111.76,27.94 113.03,26.67 113.03,19.05 114.3,17.78 IC1.15
COL7  (8 unrouted)
  Top 0.61: LED169.1 96.52,154.62 | 96.52,154.62 LED169.3 | LED57.C 96.8,154.9 96.52,154.62 | LED170.1 96.52,138.75 | 96.52,138.75 LED170.3 | LED58.C 96.8,139.03 96.52,138.75 | LED176.1 96.52,43.5 | 96.52,43.5 LED176.3 100.33,43.5 100.33,153.67 | LED175.1 96.52,59.37 | 96.52,59.37 LED175.3 | LED174.1 96.52,75.25 | 96.52,75.25 LED174.3 | LED62.C 96.8,75.53 96.52,75.25 | LED63.C 96.8,59.65 96.52,59.37 | LED64.C 96.8,43.78 96.52,43.5 | LED173.1 96.52,91.12 | 96.52,91.12 LED173.3 | LED171.1 96.52,122.87 | 96.52,122.87 LED171.3 | LED172.1 96.52,107 | 96.52,107 LED172.3 | LED59.C 96.8,123.15 96.52,122.87 | LED60.C 96.8,107.28 96.52,107 | LED61.C 96.8,91.4 96.52,91.12
  Bottom 0.406: IC1.7 111.76,25.4 109.22,27.94 X3.7
COL8  (8 unrouted)
  Top 0.61: LED162.1 83.82,138.75 | 83.82,138.75 LED162.3 | LED50.C 84.1,139.03 83.82,138.75 | LED161.1 83.82,154.62 | 83.82,154.62 LED161.3 | LED49.C 84.1,154.9 83.82,154.62 | LED168.1 83.82,43.5 | 83.82,43.5 LED168.3 87.63,43.5 87.63,153.67 | LED167.1 83.82,59.37 | 83.82,59.37 LED167.3 | LED166.1 83.82,75.25 | 83.82,75.25 LED166.3 | LED54.C 84.1,75.53 83.82,75.25 | LED55.C 84.1,59.65 83.82,59.37 | LED56.C 84.1,43.78 83.82,43.5 | LED165.1 83.82,91.12 | 83.82,91.12 LED165.3 | LED164.1 83.82,107 | 83.82,107 LED164.3 | LED163.1 83.82,122.87 | 83.82,122.87 LED163.3 | LED51.C 84.1,123.15 83.82,122.87 | LED52.C 84.1,107.28 83.82,107 | LED53.C 84.1,91.4 83.82,91.12
  Bottom 0.406: IC1.14 111.76,17.78 110.49,19.05 110.49,24.13 106.68,27.94 X3.8
COL9  (8 unrouted)
  Top 0.61: LED154.1 71.12,138.75 | 71.12,138.75 LED154.3 | LED153.1 71.12,154.62 | 71.12,154.62 LED153.3 | LED41.C 71.4,154.9 71.12,154.62 | LED42.C 71.4,139.03 71.12,138.75 | LED158.1 71.12,75.25 | 71.12,75.25 LED158.3 | LED159.1 71.12,59.37 | 71.12,59.37 LED159.3 | LED160.1 71.12,43.5 | 71.12,43.5 LED160.3 74.93,43.5 74.93,153.67 | LED46.C 71.4,75.53 71.12,75.25 | LED47.C 71.4,59.65 71.12,59.37 | LED48.C 71.4,43.78 71.12,43.5 | LED157.1 71.12,91.12 | 71.12,91.12 LED157.3 | LED155.1 71.12,122.87 | 71.12,122.87 LED155.3 | LED156.1 71.12,107 | 71.12,107 LED156.3 | LED43.C 71.4,123.15 71.12,122.87 | LED44.C 71.4,107.28 71.12,107 | LED45.C 71.4,91.4 71.12,91.12
  Bottom 0.406: IC2.4 88.9,24.13 93.98,29.21 X4.1
COL10  (1 unrouted)
  Top 0.61: 58.42,154.62 LED145.1 | 58.42,154.62 LED145.3 61.28,154.62 62.23,153.67 62.23,138.43 | LED33.C 58.7,154.9 58.42,154.62 | 58.42,138.75 LED146.1 | 58.42,138.75 LED146.3 61.91,138.75 62.23,138.43 | LED34.C 58.7,139.03 58.42,138.75 | 58.42,75.25 LED150.1 | 58.42,75.25 LED150.3 61.91,75.25 62.23,74.93 | 58.42,59.37 LED151.1 | 58.74,59.37 58.42,59.37 | 58.74,59.37 LED151.3 61.91,59.37 62.23,59.69 | LED152.1 58.42,43.5 | 58.42,43.5 LED152.3 62.23,43.5 62.23,59.69 | LED38.C 58.7,75.53 58.42,75.25 | 58.42,59.37 58.7,59.65 LED39.C 58.7,59.41 58.74,59.37 | LED40.C 58.7,43.78 58.42,43.5 | 58.42,91.12 LED149.1 | 58.42,91.12 LED149.3 61.91,91.12 62.23,91.44 | 58.42,107 LED148.1 | 58.42,107 LED148.3 61.91,107 62.23,106.68 | 58.42,122.87 LED147.1 | 58.42,122.87 LED147.3 61.91,122.87 62.23,123.19 | LED37.C 58.7,91.4 58.42,91.12 | LED36.C 58.7,107.28 58.42,107 | LED35.C 58.7,123.15 58.42,122.87 | 62.23,59.69 62.23,74.93 | 62.23,74.93 62.23,91.44 | 62.23,91.44 62.23,106.68 | 62.23,106.68 62.23,123.19 | 62.23,123.19 62.23,138.43
  Bottom 0.406: IC2.17 88.9,16.51 87.63,17.78 87.63,25.4 91.44,29.21 X4.2
COL11  (via drill 0.6)
  Top 0.61: 45.72,154.62 LED137.1 | 45.72,154.62 LED137.3 48.58,154.62 49.53,153.67 49.53,138.43 | LED25.C 46,154.9 45.72,154.62 | 45.72,138.75 LED138.1 | 45.72,138.75 LED138.3 49.21,138.75 49.53,138.43 | LED26.C 46,139.03 45.72,138.75 | 45.72,75.25 LED142.1 | 45.72,75.25 LED142.3 49.21,75.25 49.53,74.93 | LED144.1 45.72,43.5 | 45.72,43.5 LED144.3 49.53,43.5 v49.53,54.61 49.53,59.69 | 45.72,59.37 LED143.1 | 45.72,59.37 LED143.3 | LED30.C 46,75.53 45.72,75.25 | 45.72,59.37 46,59.65 LED31.C 46,59.41 46.04,59.37 49.21,59.37 49.53,59.69 | LED32.C 46,43.78 45.72,43.5 | 45.72,122.87 LED139.1 | 45.72,122.87 LED139.3 49.21,122.87 49.53,123.19 | 45.72,107 LED140.1 | 45.72,107 LED140.3 49.21,107 49.53,106.68 | 45.72,91.12 LED141.1 | 45.72,91.12 LED141.3 49.21,91.12 49.53,91.44 | LED27.C 46,123.15 45.72,122.87 | LED28.C 46,107.28 45.72,107 | LED29.C 46,91.4 45.72,91.12 | 49.53,59.69 49.53,74.93 | 49.53,74.93 49.53,91.44 | 49.53,91.44 49.53,106.68 | 49.53,106.68 49.53,123.19 | 49.53,123.19 49.53,138.43 | v90.17,54.61 90.17,40.64 88.9,39.37 X4.3
  Bottom 0.406: IC2.5 86.36,26.67 88.9,29.21 X4.3
  Bottom 0.61: v49.53,54.61 v90.17,54.61
COL12  (via drill 0.6)
  Top 0.61: 33.02,154.62 LED129.1 | 33.02,154.62 LED129.3 35.88,154.62 36.83,153.67 36.83,138.43 | LED17.C 33.3,154.9 33.02,154.62 | 33.02,138.75 LED130.1 | 33.02,138.75 LED130.3 36.51,138.75 36.83,138.43 | LED18.C 33.3,139.03 33.02,138.75 | 33.02,75.25 LED134.1 | 33.02,75.25 LED134.3 | LED136.1 33.02,43.5 | 33.02,43.5 LED136.3 36.83,43.5 v36.83,53.34 36.83,59.69 | 33.02,59.37 LED135.1 | 33.02,59.37 LED135.3 36.51,59.37 36.83,59.69 | 33.02,75.25 33.3,75.53 LED22.C 33.3,75.44 33.5,75.25 36.51,75.25 36.83,74.93 | LED23.C 33.3,59.65 33.02,59.37 | LED24.C 33.3,43.78 33.02,43.5 | 33.02,122.87 LED131.1 | 33.02,122.87 LED131.3 36.51,122.87 36.83,123.19 | 33.02,107 LED132.1 | 33.02,107 LED132.3 36.51,107 36.83,106.68 | 33.02,91.12 LED133.1 | 33.02,91.12 LED133.3 36.51,91.12 36.83,91.44 | LED19.C 33.3,123.15 33.02,122.87 | LED20.C 33.3,107.28 33.02,107 | LED21.C 33.3,91.4 33.02,91.12 | 36.83,59.69 36.83,74.93 | 36.83,74.93 36.83,91.44 | 36.83,91.44 36.83,106.68 | 36.83,106.68 36.83,123.19 | 36.83,123.19 36.83,138.43 | X4.4 86.36,39.37 88.9,41.91 v88.9,53.34
  Bottom 0.406: IC2.16 86.36,16.51 85.09,17.78 85.09,27.94 86.36,29.21 X4.4
  Bottom 0.61: v36.83,53.34 v88.9,53.34
COL13  (via drill 0.6)
  Top 0.61: 20.32,154.62 LED121.1 | 20.32,154.62 LED121.3 23.18,154.62 24.13,153.67 24.13,138.43 | LED9.C 20.6,154.9 20.32,154.62 | 20.32,138.75 LED122.1 | 20.32,138.75 LED122.3 23.81,138.75 24.13,138.43 | LED10.C 20.6,139.03 20.32,138.75 | 20.32,75.25 LED126.1 | 20.64,75.25 20.32,75.25 | 20.64,75.25 LED126.3 23.81,75.25 24.13,74.93 | LED128.1 20.32,43.5 | 20.32,43.5 LED128.3 24.13,43.5 v24.13,52.07 24.13,59.69 | 20.32,59.37 LED127.1 | 20.32,59.37 LED127.3 23.81,59.37 24.13,59.69 | 20.32,75.25 20.6,75.53 LED14.C 20.6,75.28 20.64,75.25 | LED15.C 20.6,59.65 20.32,59.37 | LED16.C 20.6,43.78 20.32,43.5 | 20.32,122.87 LED123.1 | 20.32,122.87 LED123.3 23.81,122.87 24.13,123.19 | 20.32,107 LED124.1 | 20.32,107 LED124.3 23.81,107 24.13,106.68 | 20.32,91.12 LED125.1 | 20.32,91.12 LED125.3 23.81,91.12 24.13,91.44 | LED11.C 20.6,123.15 20.32,122.87 | LED12.C 20.6,107.28 20.32,107 | LED13.C 20.6,91.4 20.32,91.12 | 24.13,59.69 24.13,74.93 | 24.13,74.93 24.13,91.44 | 24.13,91.44 24.13,106.68 | 24.13,106.68 24.13,123.19 | 24.13,123.19 24.13,138.43 | X4.5 83.82,38.1 81.28,40.64 78.74,40.64 77.47,41.91 v77.47,52.07
  Bottom 0.406: X4.5 IC2.6
  Bottom 0.61: v24.13,52.07 v77.47,52.07
COL14  (via drill 0.6)
  Top 0.61: 7.62,154.62 LED113.1 | 7.62,154.62 LED113.3 10.48,154.62 11.43,153.67 11.43,138.43 | LED1.C 7.9,154.9 7.62,154.62 | 7.62,138.75 LED114.1 | 7.62,138.75 LED114.3 11.11,138.75 11.43,138.43 | LED2.C 7.9,139.03 7.62,138.75 | 7.62,75.25 LED118.1 | 7.94,75.25 7.62,75.25 | 7.94,75.25 LED118.3 11.11,75.25 11.43,74.93 | LED120.1 7.62,43.5 | 7.62,43.5 LED120.3 11.43,43.5 v11.43,50.8 11.43,59.69 | 7.62,59.37 LED119.1 | 7.62,59.37 LED119.3 11.11,59.37 11.43,59.69 | 7.62,75.25 7.9,75.53 LED6.C 7.9,75.28 7.94,75.25 | LED7.C 7.9,59.65 7.62,59.37 | LED8.C 7.9,43.78 7.62,43.5 | 7.62,122.87 LED115.1 | 7.62,122.87 LED115.3 11.11,122.87 11.43,123.19 | 7.62,107 LED116.1 | 7.62,107 LED116.3 11.11,107 11.43,106.68 | 7.62,91.12 LED117.1 | 7.62,91.12 LED117.3 11.11,91.12 11.43,91.44 | LED3.C 7.9,123.15 7.62,122.87 | LED4.C 7.9,107.28 7.62,107 | LED5.C 7.9,91.4 7.62,91.12 | 11.43,59.69 11.43,74.93 | 11.43,74.93 11.43,91.44 | 11.43,91.44 11.43,106.68 | 11.43,106.68 11.43,123.19 | 11.43,123.19 11.43,138.43 | X4.6 81.28,38.1 80.01,39.37 77.47,39.37 76.2,40.64 v76.2,50.8
  Bottom 0.406: IC2.15 83.82,16.51 82.55,17.78 82.55,26.67 81.28,27.94 X4.6
  Bottom 0.61: v11.43,50.8 v76.2,50.8
COL15
  Bottom 0.406: IC2.7 81.28,25.4 78.74,27.94 X4.7
COL16
  Bottom 0.406: IC2.14 81.28,16.51 80.01,17.78 80.01,24.13 76.2,27.94 X4.8
DATA  (via drill 0.5)
  Top 0.406: v123.19,20.32 128.27,20.32 129.54,19.05 v147.32,19.05
  Bottom 0.406: IC1.3 121.92,21.59 v123.19,20.32 | v147.32,19.05 IC5.26
GND
  pour Bottom (isolate 0.406): -1.27,38.1 179.07,38.1 179.07,-1.27 -1.27,-1.27
  pour Top (isolate 0.406): -1.27,38.1 179.07,38.1 179.07,-1.27 -1.27,-1.27
LOAD  (via drill 0.5)
  Top 0.406: v30.48,17.78 v55.88,17.78 v76.2,17.78 101.6,17.78 102.87,19.05 v106.68,19.05 128.27,19.05 129.54,17.78 148.59,17.78 v149.86,19.05
  Bottom 0.406: IC4.12 v30.48,17.78 | v106.68,19.05 IC1.12 | v76.2,17.78 IC2.12 | v55.88,17.78 IC3.12 | v149.86,19.05 IC5.25
MISO
  Bottom 0.406: IC5.18 JP1.1
MOSI
  Bottom 0.406: IC5.17 170.18,24.13 171.45,25.4 171.45,27.94 JP1.4
N$4  (via drill 0.5)
  Top 0.406: v92.71,19.05 101.6,19.05 102.87,20.32 v120.65,20.32
  Bottom 0.406: v120.65,20.32 121.92,19.05 IC1.18 | v92.71,19.05 91.44,20.32 IC2.3
N$5  (via drill 0.5)
  Top 0.406: v60.96,19.05 v90.17,19.05
  Bottom 0.406: IC2.18 91.44,17.78 v90.17,19.05 | IC3.14 v60.96,19.05
N$6
  Top 0.406: IC3.9 43.18,13.97 40.64,11.43 36.83,11.43 35.56,12.7 IC4.14
N$7
  Bottom 0.406: IC3.15 63.5,16.51 68.58,21.59 R1.1
N$8
  Bottom 0.406: IC3.1 R2.1
N$9
  Bottom 0.406: IC3.2 R3.1
N$10
  Bottom 0.406: IC3.3 R4.1
N$11
  Bottom 0.406: IC3.4 R5.1
N$12
  Bottom 0.406: IC3.5 R6.1
N$13
  Bottom 0.406: IC3.6 R7.1
N$14
  Bottom 0.406: IC3.7 R8.1
N$15
  Bottom 0.406: C9.1 133.35,19.05 133.35,12.7 134.62,11.43 148.59,11.43 149.86,10.16 X5.6
N$16
  Bottom 0.406: IC4.15 38.1,16.51 43.18,21.59 R9.1
N$17
  Bottom 0.406: IC4.1 R10.1
N$18
  Bottom 0.406: IC4.2 R11.1
N$19
  Bottom 0.406: IC4.3 R12.1
N$20
  Bottom 0.406: IC4.4 R13.1
N$21
  Bottom 0.406: IC4.5 R14.1
N$22
  Bottom 0.406: IC4.6 R15.1
N$23
  Bottom 0.406: IC4.7 R16.1
N$37
  Bottom 0.406: IC6.2 Q1.1
N$54
  Bottom 0.61: IC5.21 C5.1
N$55
  Bottom 0.406: IC6.1 Q1.2
N$56
  Bottom 1.016: X6.1 12.7,11.43 12.7,7.62 D1.A
N$57
  Bottom 1.016: D1.C 19.56,4.32 C10.+ 19.56,22.35 IC7.1
N$58  (via drill 0.5)
  Top 0.406: v133.35,22.86 134.62,24.13 134.62,27.94 135.89,29.21 140.97,29.21 142.24,30.48 IC6.3
  Bottom 0.406: BAT1.PWR@1 114.05,8.64 115.57,10.16 130.81,10.16 132.08,11.43 132.08,21.59 v133.35,22.86
RESET  (via drill 0.5)
  Top 0.406: v152.4,16.51 v171.45,16.51
  Bottom 0.406: 138.43,13.97 IC5.1 142.24,15.24 143.51,16.51 v152.4,16.51 | 138.43,13.97 R19.1 | v171.45,16.51 171.45,24.13 172.72,25.4 JP1.5 | C9.2 135.89,13.97 138.43,13.97
ROW1  (1 unrouted)
  Top 0.61: LED17.A 30.2,158.71 LED129.2 | LED25.A 42.9,158.71 LED137.2 | LED9.A 17.5,158.71 LED121.2 | LED1.A 4.8,158.71 LED113.2 | LED33.A 55.6,158.71 LED145.2 | LED41.A 68.3,158.71 LED153.2 | LED49.A 81,158.71 LED161.2 | LED57.A 93.7,158.71 LED169.2 | LED65.A 106.4,158.71 LED177.2 | LED73.A 119.1,158.71 LED185.2 | LED81.A 131.8,158.71 LED193.2 | LED89.A 144.5,158.71 LED201.2 | LED105.A 169.9,158.71 LED217.2 | LED97.A 157.2,158.71 LED209.2
  Bottom 0.406: R1.2 X1.1
  Bottom 0.61: LED201.2 LED193.2 | LED193.2 LED185.2 | LED185.2 LED169.2 | LED169.2 LED153.2 | LED153.2 LED121.2 | LED121.2 LED113.2 | LED209.2 LED217.2 | LED209.2 | LED201.2 LED209.2 | LED201.2 | LED201.2 LED193.2 | LED193.2 | LED193.2 LED185.2 | LED185.2 | LED185.2 LED177.2 | LED177.2 | LED177.2 LED169.2 | LED169.2 | LED169.2 LED161.2 LED153.2 | LED153.2 | LED153.2 LED145.2 LED137.2 LED129.2 LED121.2 | LED121.2
ROW2  (1 unrouted)
  Top 0.61: LED90.A 144.5,142.84 LED202.2 | LED82.A 131.8,142.84 LED194.2 | LED74.A 119.1,142.84 LED186.2 | LED66.A 106.4,142.84 LED178.2 | LED58.A 93.7,142.84 LED170.2 | LED50.A 81,142.84 LED162.2 | LED42.A 68.3,142.84 LED154.2 | LED34.A 55.6,142.84 LED146.2 | LED26.A 42.9,142.84 LED138.2 | LED18.A 30.2,142.84 LED130.2 | LED10.A 17.5,142.84 LED122.2 | LED2.A 4.8,142.84 LED114.2 | LED98.A 157.2,142.84 LED210.2 | LED106.A 169.9,142.84 LED218.2
  Bottom 0.406: R2.2 X1.2
  Bottom 0.61: LED202.2 LED186.2 | LED186.2 LED178.2 | LED178.2 LED170.2 | LED138.2 LED114.2 | LED218.2 LED210.2 LED202.2 | LED202.2 | LED202.2 LED194.2 | LED194.2 | LED194.2 LED186.2 | LED186.2 | LED186.2 LED178.2 | LED178.2 | LED178.2 LED170.2 | LED170.2 | LED170.2 LED162.2 LED154.2 LED146.2 LED138.2 | LED138.2 LED130.2 | LED130.2 | LED114.2 LED122.2 | LED114.2
ROW3  (via drill 0.6)
  Top 0.61: LED3.A 4.8,126.96 LED115.2 | LED11.A 17.5,126.96 LED123.2 | LED19.A 30.2,126.96 LED131.2 | LED27.A 42.9,126.96 LED139.2 | LED35.A 55.6,126.96 LED147.2 | LED43.A 68.3,126.96 LED155.2 64.77,125.41 v64.77,40.64 | LED51.A 81,126.96 LED163.2 | LED59.A 93.7,126.96 LED171.2 | LED67.A 106.4,126.96 LED179.2 | LED75.A 119.1,126.96 LED187.2 | LED83.A 131.8,126.96 LED195.2 | LED91.A 144.5,126.96 LED203.2 | LED99.A 157.2,126.96 LED211.2 | LED107.A 169.9,126.96 LED219.2
  Bottom 0.406: X1.3 R3.2
  Bottom 0.61: LED211.2 LED203.2 | LED203.2 LED187.2 | LED187.2 LED171.2 | LED171.2 LED163.2 | LED163.2 LED155.2 | LED155.2 LED115.2 | LED219.2 | LED219.2 LED211.2 | LED211.2 | LED211.2 LED203.2 | LED203.2 | LED203.2 LED195.2 LED187.2 | LED187.2 | LED187.2 LED179.2 LED171.2 | LED171.2 | LED171.2 LED163.2 | LED163.2 | LED163.2 LED155.2 | LED155.2 | LED155.2 LED147.2 | LED147.2 | LED147.2 LED139.2 LED131.2 LED123.2 | X1.3 63.5,39.37 v64.77,40.64
ROW4  (via drill 0.6)
  Top 0.61: LED28.A 42.9,111.09 LED140.2 | LED20.A 30.2,111.09 LED132.2 | LED12.A 17.5,111.09 LED124.2 | LED4.A 4.8,111.09 LED116.2 | LED36.A 55.6,111.09 LED148.2 | LED44.A 68.3,111.09 LED156.2 | LED52.A 81,111.09 LED164.2 | LED60.A 93.7,111.09 LED172.2 | LED68.A 106.4,111.09 LED180.2 | LED76.A 119.1,111.09 LED188.2 | LED84.A 131.8,111.09 LED196.2 | LED92.A 144.5,111.09 LED204.2 | LED100.A 157.2,111.09 LED212.2 | LED108.A 169.9,111.09 LED220.2 | v63.5,41.91 v63.5,112.08 | v63.5,112.08
  Bottom 0.406: R4.2 X1.4
  Bottom 0.61: LED124.2 LED116.2 | LED132.2 LED124.2 | LED148.2 LED132.2 | LED156.2 LED148.2 | LED156.2 LED180.2 | LED180.2 LED220.2 LED212.2 | LED212.2 | LED212.2 LED204.2 LED196.2 LED188.2 LED180.2 | LED180.2 | LED180.2 LED172.2 LED164.2 LED156.2 | LED156.2 | LED148.2 v63.5,112.08 LED156.2 | LED148.2 | LED148.2 LED140.2 LED132.2 | LED132.2 | LED132.2 LED124.2 | LED124.2 | X1.4 60.96,39.37 v63.5,41.91
ROW5  (via drill 0.6)
  Top 0.61: LED109.A 169.9,95.21 LED221.2 | LED101.A 157.2,95.21 LED213.2 | LED93.A 144.5,95.21 LED205.2 | LED85.A 131.8,95.21 LED197.2 | LED77.A 119.1,95.21 LED189.2 | LED69.A 106.4,95.21 LED181.2 | LED61.A 93.7,95.21 LED173.2 | LED53.A 81,95.21 LED165.2 | LED45.A 68.3,95.21 LED157.2 | LED37.A 55.6,95.21 LED149.2 52.07,93.66 v52.07,71.12 | LED5.A 4.8,95.21 LED117.2 | LED13.A 17.5,95.21 LED125.2 | LED21.A 30.2,95.21 LED133.2 | LED29.A 42.9,95.21 LED141.2 | v60.96,45.72 v60.96,55.88 | v60.96,62.23 v60.96,71.12
  Bottom 0.406: R5.2 X1.5
  Bottom 0.61: LED157.2 LED117.2 | LED157.2 LED173.2 | LED173.2 LED189.2 | LED189.2 LED197.2 | LED197.2 LED221.2 LED213.2 LED205.2 LED197.2 | LED197.2 | LED189.2 LED197.2 | LED189.2 | LED189.2 LED181.2 LED173.2 | LED173.2 | LED173.2 LED165.2 LED157.2 | LED157.2 | LED157.2 LED149.2 LED141.2 LED133.2 LED125.2 | X1.5 58.42,39.37 60.96,41.91 v60.96,45.72 | v60.96,55.88 v60.96,62.23 | v60.96,71.12 v52.07,71.12
ROW6  (via drill 0.6)
  Top 0.61: LED110.A 169.9,79.34 LED222.2 | LED102.A 157.2,79.34 LED214.2 | LED94.A 144.5,79.34 LED206.2 | LED86.A 131.8,79.34 LED198.2 | LED78.A 119.1,79.34 LED190.2 | LED70.A 106.4,79.34 LED182.2 | LED62.A 93.7,79.34 LED174.2 | LED54.A 81,79.34 LED166.2 | LED46.A 68.3,79.34 LED158.2 | LED38.A 55.6,79.34 LED150.2 53.34,79.06 v53.34,41.91 | LED30.A 42.9,79.34 LED142.2 | LED22.A 30.2,79.34 LED134.2 | LED14.A 17.5,79.34 LED126.2 | LED6.A 4.8,79.34 LED118.2
  Bottom 0.406: X1.6 R6.2
  Bottom 0.61: LED134.2 LED118.2 | LED134.2 LED142.2 | LED142.2 LED150.2 | LED150.2 LED166.2 | LED166.2 LED174.2 | LED174.2 LED190.2 | LED190.2 LED222.2 LED214.2 LED206.2 LED198.2 LED190.2 | LED190.2 | LED190.2 LED182.2 LED174.2 | LED174.2 | LED166.2 LED174.2 | LED166.2 | LED166.2 LED158.2 LED150.2 | LED150.2 | LED142.2 LED150.2 | LED142.2 | LED134.2 LED142.2 | LED134.2 | LED134.2 LED126.2 | X1.6 55.88,39.37 v53.34,41.91
ROW7  (via drill 0.6)
  Top 0.61: LED7.A 4.8,63.46 LED119.2 | LED15.A 17.5,63.46 LED127.2 | LED23.A 30.2,63.46 LED135.2 | LED31.A 42.9,63.46 LED143.2 | LED39.A 55.6,63.46 LED151.2 | LED47.A 68.3,63.46 LED159.2 | LED55.A 81,63.46 LED167.2 | LED63.A 93.7,63.46 LED175.2 | LED71.A 106.4,63.46 LED183.2 | LED79.A 119.1,63.46 LED191.2 | LED87.A 131.8,63.46 LED199.2 | LED95.A 144.5,63.46 LED207.2 | LED103.A 157.2,63.46 LED215.2 | LED111.A 169.9,63.46 LED223.2 | v52.07,64.45 v52.07,40.64
  Bottom 0.406: X1.7 R7.2
  Bottom 0.61: LED119.2 LED127.2 | LED127.2 v52.07,64.45 LED151.2 | LED151.2 LED183.2 | LED183.2 LED199.2 | LED199.2 LED215.2 | LED215.2 LED223.2 LED215.2 | LED215.2 | LED215.2 LED207.2 LED199.2 | LED199.2 | LED199.2 LED191.2 LED183.2 | LED183.2 | LED183.2 LED175.2 LED167.2 LED159.2 LED151.2 | LED151.2 | LED151.2 LED143.2 LED135.2 LED127.2 | X1.7 53.34,39.37 v52.07,40.64
ROW8
  Top 0.61: LED8.A 4.8,47.59 LED120.2 | LED16.A 17.5,47.59 LED128.2 | LED24.A 30.2,47.59 LED136.2 | LED32.A 42.9,47.59 LED144.2 | LED40.A 55.6,47.59 LED152.2 | LED48.A 68.3,47.59 LED160.2 | LED56.A 81,47.59 LED168.2 | LED64.A 93.7,47.59 LED176.2 | LED72.A 106.4,47.59 LED184.2 | LED80.A 119.1,47.59 LED192.2 | LED88.A 131.8,47.59 LED200.2 | LED96.A 144.5,47.59 LED208.2 | LED104.A 157.2,47.59 LED216.2 | LED112.A 169.9,47.59 LED224.2
  Bottom 0.406: X1.8 R8.2
  Bottom 0.61: LED136.2 LED120.2 | LED136.2 50.8,48.58 | 50.8,48.58 LED152.2 | LED152.2 LED176.2 | LED176.2 LED184.2 | LED184.2 LED224.2 LED216.2 LED208.2 LED200.2 LED192.2 LED184.2 | LED184.2 | LED176.2 LED184.2 | LED176.2 | LED176.2 LED168.2 LED160.2 LED152.2 | LED152.2 | LED152.2 LED144.2 LED136.2 | LED136.2 | LED136.2 LED128.2 | 50.8,48.58 X1.8
ROW9
  Bottom 0.406: R9.2 X2.1
ROW10
  Bottom 0.406: R10.2 X2.2
ROW11
  Bottom 0.406: R11.2 X2.3
ROW12
  Bottom 0.406: R12.2 X2.4
ROW13
  Bottom 0.406: R13.2 X2.5
ROW14
  Bottom 0.406: R14.2 X2.6
ROW15
  Bottom 0.406: R15.2 X2.7
ROW16
  Bottom 0.406: R16.2 X2.8
RXD
  Top 0.406: X5.4 IC5.2
SCK
  Bottom 0.406: JP1.3 168.91,25.4 168.91,20.32 167.64,19.05 166.37,19.05 165.1,20.32 IC5.19
SCL
  Top 0.406: R17.1 146.05,31.75 140.97,31.75 139.7,30.48 IC6.6
  Bottom 0.406: IC5.28 142.24,22.86 140.97,24.13 140.97,29.21 139.7,30.48 IC6.6
SDA
  Top 0.406: R18.1 146.05,34.29 140.97,34.29 139.7,33.02 IC6.5
  Bottom 0.406: IC5.27 144.78,22.86 142.24,25.4 142.24,30.48 139.7,33.02 IC6.5
TXD
  Top 0.406: X5.5 IC5.3